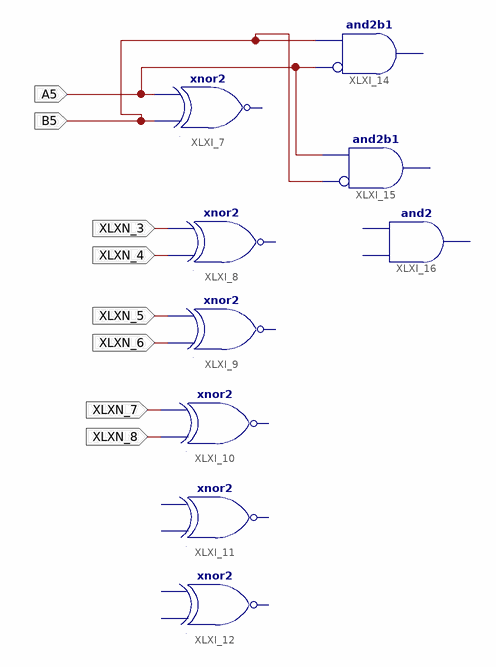
[diagram p0: schematic sheet 1]
// Xilinx ISE schematic comparador6bits.sch (spartan3e) as structural Verilog: 9 symbols, 8 ports
module comparador6bits (
  input  XLXN_3,
  input  XLXN_4,
  input  XLXN_5,
  input  XLXN_6,
  input  XLXN_7,
  input  XLXN_8,
  input  A5,
  input  B5
);

  // xnor2 XLXI_8 has open pins: I0=XLXN_4, I1=XLXN_3, O=open
  // xnor2 XLXI_9 has open pins: I0=XLXN_6, I1=XLXN_5, O=open
  // xnor2 XLXI_10 has open pins: I0=XLXN_8, I1=XLXN_7, O=open
  // xnor2 XLXI_11 is placed but not wired
  // xnor2 XLXI_12 is placed but not wired
  // xnor2 XLXI_7 has open pins: I0=B5, I1=A5, O=open
  // and2b1 XLXI_14 has open pins: I0=A5, I1=B5, O=open
  // and2b1 XLXI_15 has open pins: I0=B5, I1=A5, O=open
  // and2 XLXI_16 is placed but not wired
endmodule
